# EasyEDA Pro project 1.eprj

# Schematic Schematic1
Create Date: 2023-11-05; Page Name: P1; Project Name: 1; Schematic Name: Schematic1; Update Date: 2023-11-05; Company: 嘉立创EDA; Page Size: A4; Version: V1.0
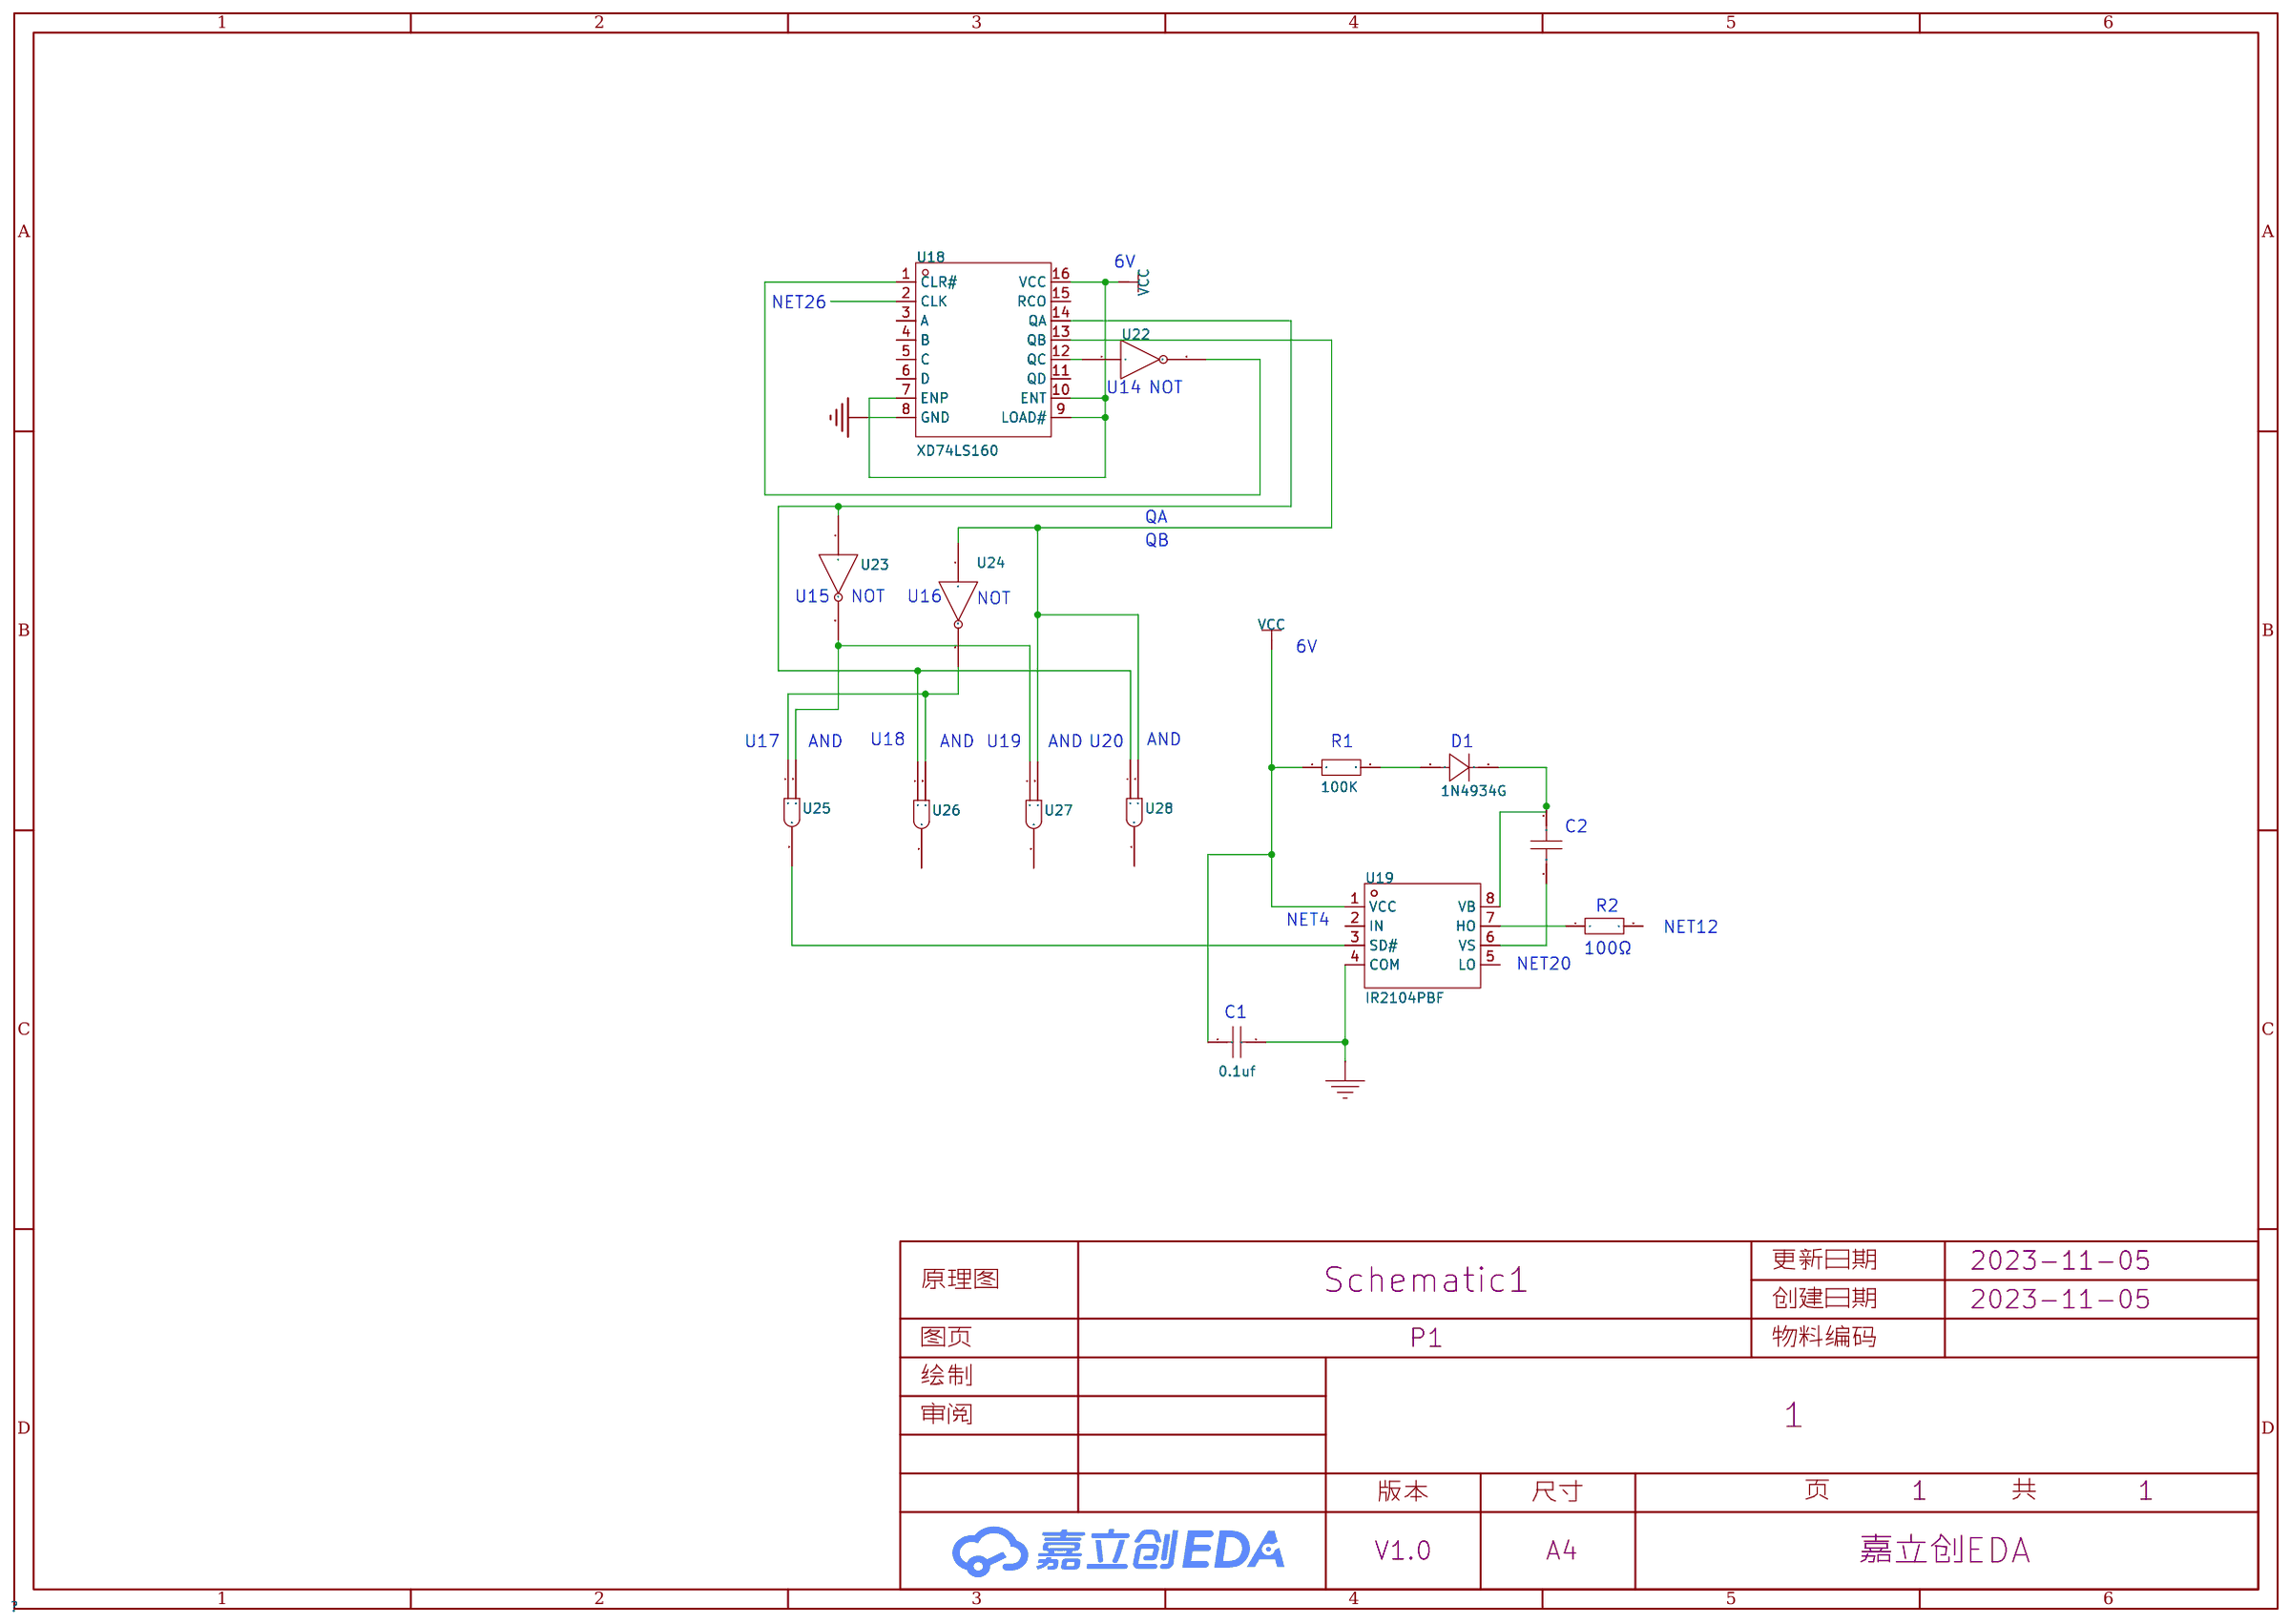
[diagram p0: schematic sheet]

## Parts
C24  100nF  [C0603]
R17  100K  [R0603]
R18  10K  [R0603]
U18  XD74LS160  [DIP-16_L19.8-W6.5-P2.54-LS7.6-BL]
U19  IR2104PBF  [DIP-8_L9.9-W6.6-P2.54-LS7.62-BL]
U20  1N4934G  [SMA_L4.3-W2.6-LS5.1-RD]
U22  -
U23  -
U24  -
U25  -
U26  -
U27  -
U28  -
U?#1  0.1uf

## Library data of the parts
C24 = CAP_0603: Supplier Footprint: 0603
R17 R18 = Res_0603: Supplier Footprint: 0603
U18 = XD74LS160: 逻辑电路 计数器/分频器; LCSC Part Name: 计数器 IC; Supplier Part: C968687; Manufacturer: XINLUDA(信路达); Supplier Footprint: DIP-16; JLCPCB Part Class: 扩展库; Supplier: LCSC
U19 = IR2104PBF: 驱动配置:半桥;负载类型:MOSFET；IGBT;电源电压:10V~20V;峰值灌电流:360mA;峰值拉电流:210mA;; Supplier Part: C2959; Manufacturer: Infineon(英飞凌); Supplier Footprint: DIP-8; JLCPCB Part Class: 扩展库; Datasheet: https://atta.szlcsc.com/upload/public/pdf/source/20140906/1457707236579.pdf; Supplier: LCSC; Driven Configuration: 半桥; Number of Drivers: 2; Load Type: MOSFET；IGBT; Supply Voltage: 10V~20V; Peak Output Current(sink): 360mA; Peak Output Current(source): 210mA; Rise Time: 100ns; Fall Time: 50ns; Operating Temperature: -40℃~+150℃@(Tj)
U20 = 1N4007: Supplier Part: C9900004759; JLCPCB Part Class: Extended Part; Supplier: LCSC
U22-U24 = 反相器
U25-U28 = 与门
U?#1 = Capacitor: SimulationGenericComponent: True; Library Name: Simulation Generic Components

## Nets
GND: U18.8(GND) U19.4(COM) U?#1.2
VCC: R17.1 U18.7(ENP) U18.9(LOAD#) U18.10(ENT) U18.16(VCC) U19.1(VCC) U?#1.1
Net-(C24-1): C24.1 U19.6(VS)
Net-(C24-2): C24.2 U19.8(VB) U20.1(K)
Net-(R17-2): R17.2 U20.2(A)
Net-(R18-1): R18.1 U19.7(HO)
Net-(U18-1): U18.1(CLR#) U22.2
Net-(U18-12): U18.12(QC) U22.1
Net-(U18-13): U18.13(QB) U24.1 U27.3 U28.3
Net-(U18-14): U18.14(QA) U23.1 U26.1 U28.1
Net-(U19-3): U19.3(SD#) U25.2
Net-(U23-2): U23.2 U25.3 U27.1
Net-(U24-2): U24.2 U25.1 U26.3

Not connected (* = marked no-connect by the designer): R18 2; U18 2(CLK) 3(A) 4(B) 5(C) 6(D) 11(QD) 15(RCO); U19 2(IN) 5(LO); U26 2; U27 2; U28 2

## Notes on the sheet
- 6V
- NET26
- U14
- NOT
- QA
- QB
- U15
- NOT
- U16
- NOT
- 6V
- U17
- AND
- U18
- AND
- U19
- AND
- U20
- AND
- R1
- D1
- C2
- NET4
- R2
- NET12
- 100Ω
- NET20
- C1
